# EAGLE design MotorDriver (EAGLE 5.11)
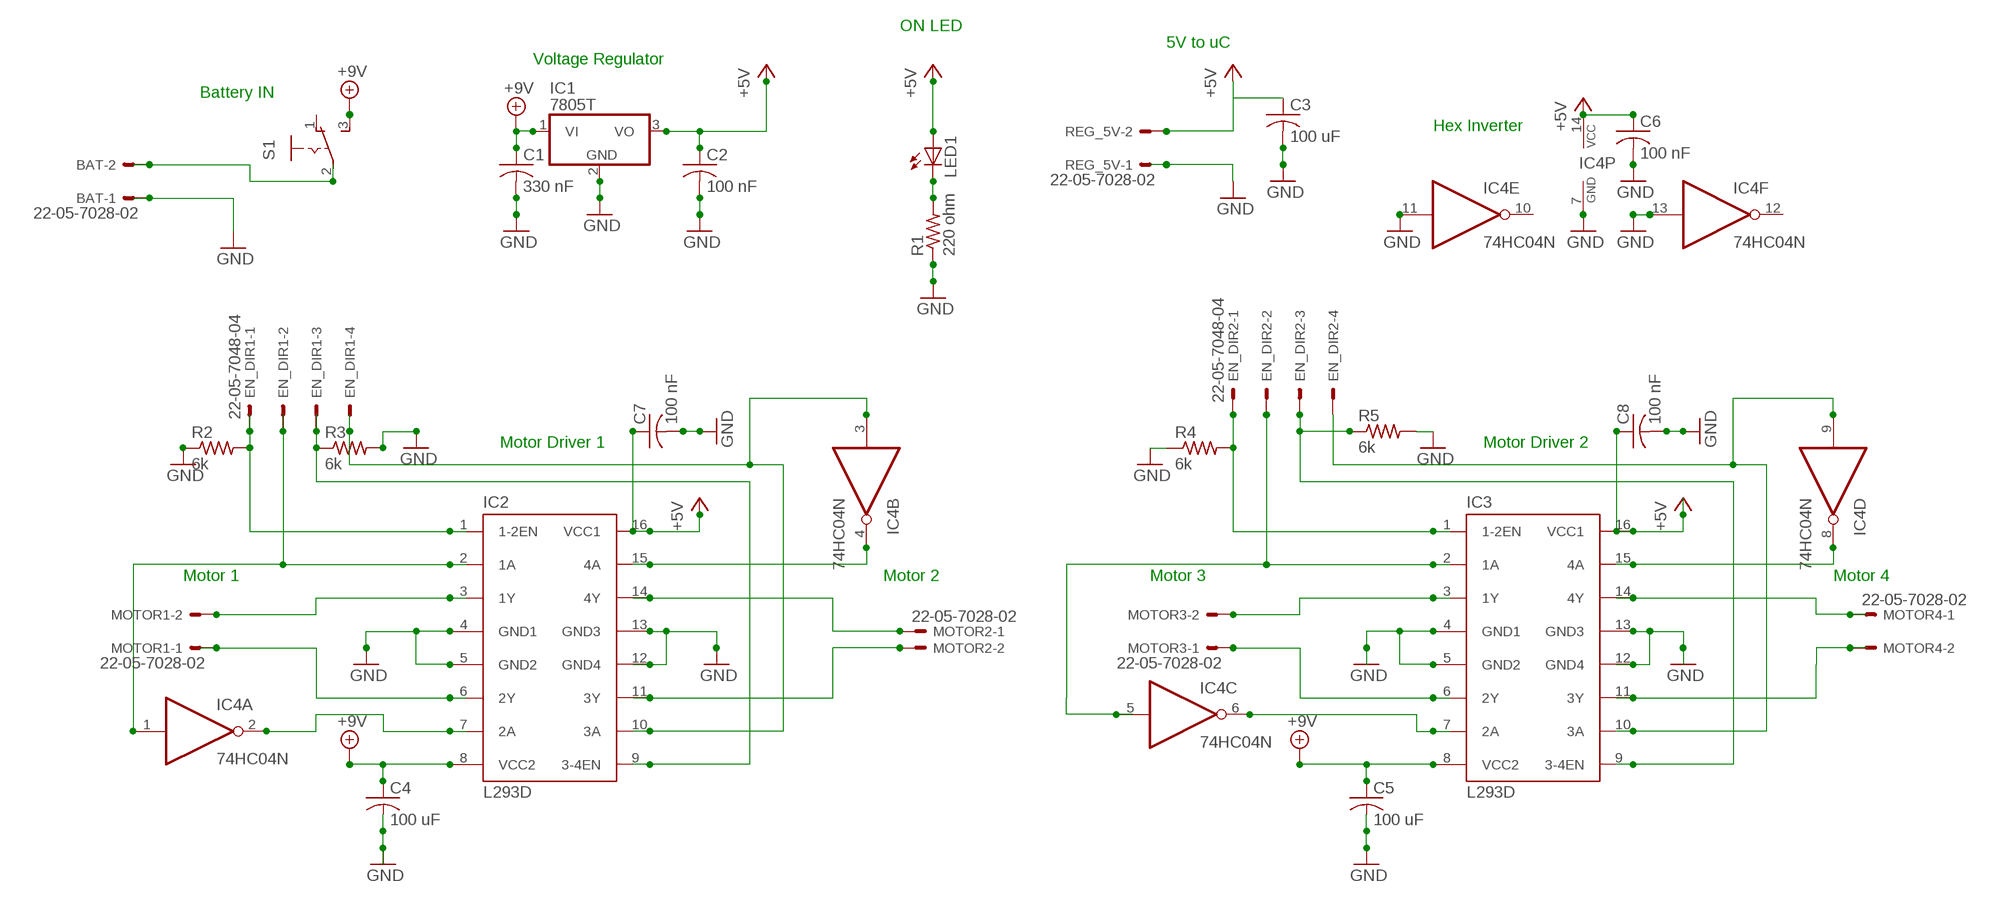
[diagram p0: schematic, sheet 1]

## Parts
BAT  22-05-7028-02  [7395-02]
C1  330 nF  C-US025-025X050  [C025-025X050]
C2  100 nF  C-US025-025X050  [C025-025X050]
C3  100 uF  C-US025-060X050  [C025-060X050]
C4  100 uF  C-US025-060X050  [C025-060X050]
C5  100 uF  C-US025-060X050  [C025-060X050]
C6  100 nF  C-US025-025X050  [C025-025X050]
C7  100 nF  C-US025-025X050  [C025-025X050]
C8  100 nF  C-US025-025X050  [C025-025X050]
EN_DIR1  22-05-7048-04  [7395-04]
EN_DIR2  22-05-7048-04  [7395-04]
IC1  7805T  [TO220H]
IC2  L293D  [DIL16]
IC3  L293D  [DIL16]
IC4  74HC04N  [DIL14]
LED1  LED3MM  [LED3MM]
MOTOR1  22-05-7028-02  [7395-02]
MOTOR2  22-05-7028-02  [7395-02]
MOTOR3  22-05-7028-02  [7395-02]
MOTOR4  22-05-7028-02  [7395-02]
R1  220 ohm  R-US_0207/7  [0207/7]
R2  6k  R-US_0207/7  [0207/7]
R3  6k  R-US_0207/7  [0207/7]
R4  6k  R-US_0207/7  [0207/7]
R5  6k  R-US_0207/7  [0207/7]
REG_5V  22-05-7028-02  [7395-02]
S1  255SB  [255SB]

## Nets
+5V: C2.1 C3.1 C6.1 C7.1 C8.1 IC1.3(VO) IC2.16(VCC1) IC3.16(VCC1) IC4.14(P:VCC) LED1.A REG_5V.2
+9V: C1.1 C4.1 C5.1 IC1.1(VI) IC2.8(VCC2) IC3.8(VCC2) S1.3(S)
EN_DIR1: EN_DIR1.4 IC2.10(3A) IC4.3(B:I)
EN_DIR2: EN_DIR2.4 IC3.10(3A) IC4.9(D:I)
GND: BAT.1 C1.2 C2.2 C3.2 C4.2 C5.2 C6.2 C7.2 C8.2 IC1.2(GND) IC2.4(GND1) IC2.5(GND2) IC2.12(GND4) IC2.13(GND3) IC3.4(GND1) IC3.5(GND2) IC3.12(GND4) IC3.13(GND3) IC4.7(P:GND) IC4.11(E:I) IC4.13(F:I) R1.1 R2.1 R3.2 R4.1 R5.2 REG_5V.1
N$1: BAT.2 S1.2(P)
N$2: EN_DIR1.1 EN_DIR2.2 IC2.1(1-2EN) IC3.2(1A) IC4.5(C:I) R2.2
N$3: EN_DIR1.3 IC2.9(3-4EN) R3.1
N$4: EN_DIR1.2 IC2.2(1A) IC4.1(A:I)
N$10: IC2.7(2A) IC4.2(A:O)
N$12: IC2.3(1Y) MOTOR1.2
N$13: IC2.6(2Y) MOTOR1.1
N$14: IC2.14(4Y) MOTOR2.1
N$15: IC2.11(3Y) MOTOR2.2
N$16: EN_DIR2.1 IC3.1(1-2EN) R4.2
N$17: EN_DIR2.3 IC3.9(3-4EN) R5.1
N$22: IC2.15(4A) IC4.4(B:O)
N$23: IC3.3(1Y) MOTOR3.2
N$24: IC3.6(2Y) MOTOR3.1
N$25: IC3.14(4Y) MOTOR4.1
N$26: IC3.11(3Y) MOTOR4.2
N$27: IC3.7(2A) IC4.6(C:O)
N$28: IC3.15(4A) IC4.8(D:O)
POWER_LED: LED1.K(C) R1.2
Unconnected: IC4.10(E:O) IC4.12(F:O) S1.1(O)

## Notes on the sheet
- ON LED
- 5V to uC
- Voltage Regulator
- Battery IN
- Hex Inverter
- Motor Driver 1 | Motor Driver 2
- Motor 1 | Motor 2 | Motor 3 | Motor 4

## Library data of the parts
BAT MOTOR1-MOTOR4 REG_5V = con-molex:22-?-02: CONNECTOR wire to board 2.54 mm (.1 inch) pitch header; OC_FARNELL: 9731601; OC_NEWARK: unknown
C1-C8 = rcl:C-US: CAPACITOR, American symbol
EN_DIR1 EN_DIR2 = con-molex:22-?-04: CONNECTOR wire to board 2.54 mm (.1 inch) pitch header; OC_FARNELL: unknown; OC_NEWARK: unknown
IC1 = linear:78*: Positive VOLTAGE REGULATOR Source: http://cache.national.com/ds/LM/LM78L05.pdf http://www.fairchildsemi.com/ds/LM/LM7805.pdf
IC2 IC3 = st-microelectronics:L293D: PUSH-PULL 4 CHANNEL DRIVER; MPN: L293D; OC_FARNELL: 9589619; OC_NEWARK: 56P8249
IC4 = 74xx-eu:74*04: Hex INVERTER
LED1 = led:LED: LED OSRAM: - CHIPLED LG R971, LG N971, LY N971, LG Q971, LY Q971, LO R971, LY R971 LH N974, LH R974 LS Q976, LO Q976, LY Q976 LO Q996 - Hyper CHIPLED LW Q18S LB Q993, LB Q99A, LB R99A - SideLED LS A670, LO A670, LY A670, LG A670, LP A670 LB A673, LV A673, LT A673, LW A673 LH A674 LY A675 LS A676, LA A676, LO A676, LY A676, LW A676 LS A679, LY A679, LG A679 - Hyper Micro SIDELED® LS Y876, LA Y876, LO Y876, LY Y876 LT Y87S - SmartLED LW L88C, LW L88S LB L89C, LB L89S, LG L890 LS L89K, LO L89K, LY L89K LS L896, LA L896, LO L896, LY L896 - TOPLED LS T670, LO T670, LY T670, LG T670, LP T670 LSG T670, LSP T670, LSY T670, LOP T670, LYG T670 LG T671, LOG T671, LSG T671 LB T673, LV T673, LT T673, LW T673 LH T674 LS T676, LA T676, LO T676, LY T676, LB T676, LH T676, LSB T676, LW T676 LB T67C, LV T67C, LT T67C, LS T67K, LO T67K, LY T67K, LW E67C LS E67B, LA E67B, LO E67B, LY E67B, LB E67C, LV E67C, LT E67C LW T67C LS T679, LY T679, LG T679 LS T770, LO T770, LY T770, LG T770, LP T770 LB T773, LV T773, LT T773, LW T773 LH T774 LS E675, LA E675, LY E675, LS T675 LS T776, LA T776, LO T776, LY T776, LB T776 LHGB T686 LT T68C, LB T68C - Hyper Mini TOPLED® LB M676 - Mini TOPLED Santana® LG M470 LS M47K, LO M47K, LY M47K Source: http://www.osram.convergy.de LUXEON: - LUMILED® LXK2-PW12-R00, LXK2-PW12-S00, LXK2-PW14-U00, LXK2-PW14-V00 LXK2-PM12-R00, LXK2-PM12-S00, LXK2-PM14-U00 LXK2-PE12-Q00, LXK2-PE12-R00, LXK2-PE12-S00, LXK2-PE14-T00, LXK2-PE14-U00 LXK2-PB12-K00, LXK2-PB12-L00, LXK2-PB12-M00, LXK2-PB14-N00, LXK2-PB14-P00, LXK2-PB14-Q00 LXK2-PR12-L00, LXK2-PR12-M00, LXK2-PR14-Q00, LXK2-PR14-R00 LXK2-PD12-Q00, LXK2-PD12-R00, LXK2-PD12-S00 LXK2-PH12-R00, LXK2-PH12-S00 LXK2-PL12-P00, LXK2-PL12-Q00, LXK2-PL12-R00 Source: www.luxeon.com KINGBRIGHT: KA-3528ASYC Source: www.kingbright.com
R1-R5 = rcl:R-US_: RESISTOR, American symbol
S1 = switch:255SB: SLIDING SWITCH Distributor Buerklin, 11G810

## Board
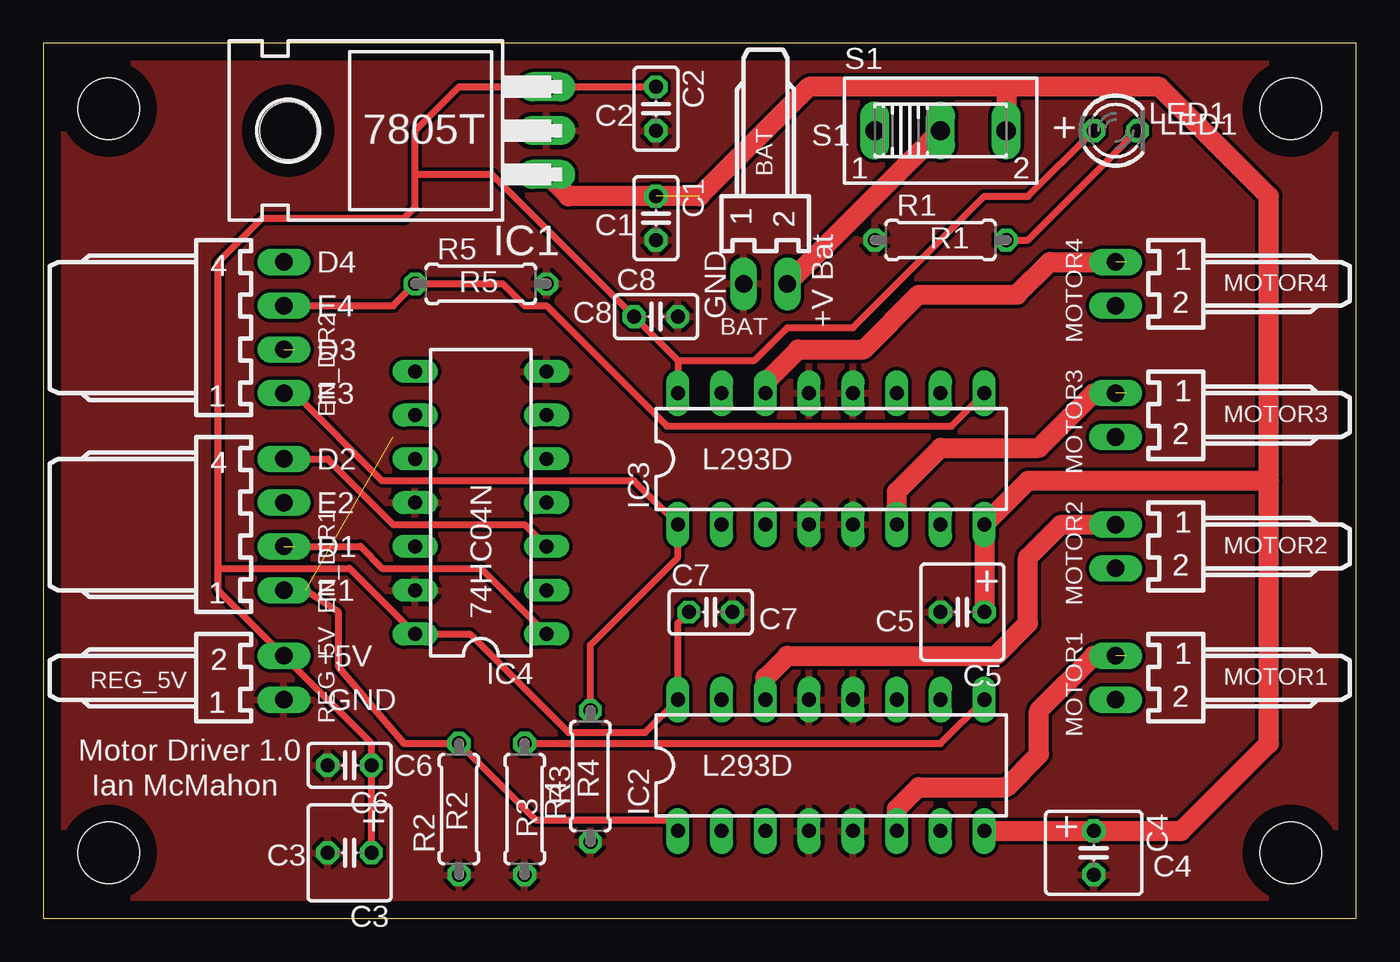
[diagram p1: board, top side]
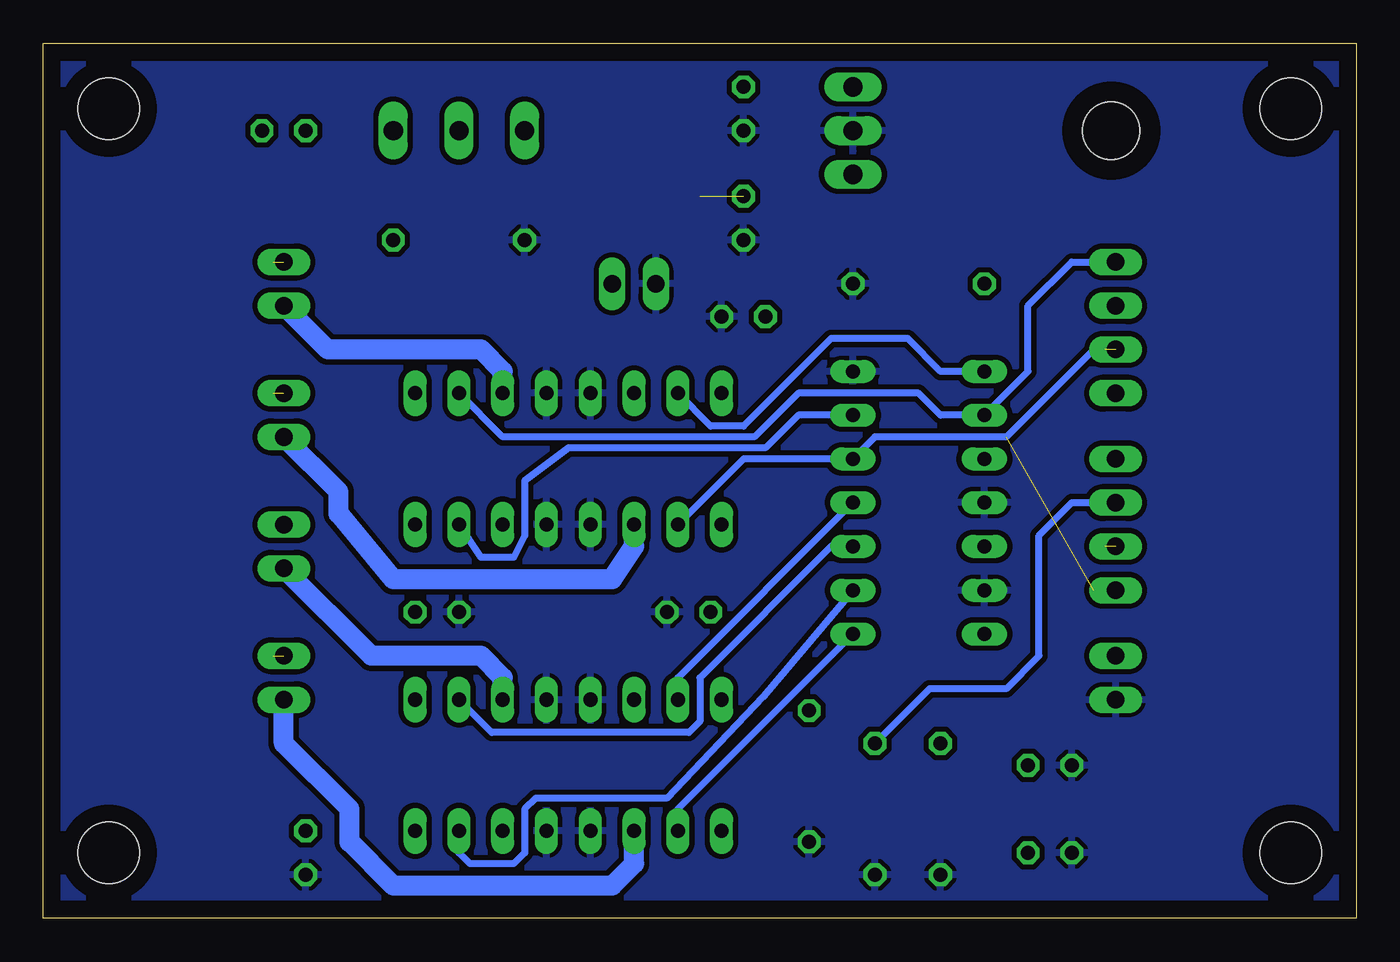
[diagram p2: board, bottom side, seen from below]

Size 76.2 x 50.8 mm. Coordinates in mm from the lower left corner, seen from the top.
Outline: 0,0 76.2,0 76.2,50.8 0,50.8 0,0
Copper layers (1*16): Top 0.035mm / dielectric 1.5mm / Bottom 0.035mm
Design rules "default": minimum track width 10mil, minimum drill 24mil, track to track 8mil, track to pad 8mil, pad to pad 8mil, via to via 8mil, smd to smd 8mil, copper to edge 40mil, drill to drill 8mil, minimum pad ring 10mil, minimum via ring 8mil, stop-mask expansion 4mil, vias tented up to drill 0mil, thermal gap 10mil
Holes 3.56 mm at 3.81,46.99 3.81,3.81 72.39,3.81 72.39,46.99

### Footprints (pad centres in the part's own frame; a part is rotated, then mirrored left to right if it is on the bottom)
7395-02 = drill 1.016 long: 1 1.27,0; 2 -1.27,0
C025-025X050 = drill 0.813 octagon: 1 -1.27,0; 2 1.27,0
C025-060X050 = drill 0.813 octagon: 1 -1.27,0; 2 1.27,0
7395-04 = drill 1.016 long: 1 3.81,0; 2 1.27,0; 3 -1.27,0; 4 -3.81,0
TO220H = drill 1.118 long: 1 -2.54,-10.16; 2 0,-10.16; 3 2.54,-10.16 | hole 3.302: 0,4.826
DIL16 = drill 0.813 long: 1 -8.89,-3.81; 2 -6.35,-3.81; 3 -3.81,-3.81; 4 -1.27,-3.81; 5 1.27,-3.81; 6 3.81,-3.81; 7 6.35,-3.81; 8 8.89,-3.81; 9 8.89,3.81; 10 6.35,3.81; 11 3.81,3.81; 12 1.27,3.81; 13 -1.27,3.81; 14 -3.81,3.81; 15 -6.35,3.81; 16 -8.89,3.81
DIL14 = drill 0.813 long: 1 -7.62,-3.81; 2 -5.08,-3.81; 3 -2.54,-3.81; 4 0,-3.81; 5 2.54,-3.81; 6 5.08,-3.81; 7 7.62,-3.81; 8 7.62,3.81; 9 5.08,3.81; 10 2.54,3.81; 11 0,3.81; 12 -2.54,3.81; 13 -5.08,3.81; 14 -7.62,3.81
LED3MM = drill 0.813 octagon: A -1.27,0; K 1.27,0
0207/7 = drill 0.813 octagon: 1 -3.81,0; 2 3.81,0
255SB = drill 1.118 long: 1 -3.81,0; 2 0,0; 3 3.81,0

### Placement (x,y rotation side)
BAT  41.91,36.83 180 top
C1  35.56,40.64 270 top
C2  35.56,46.99 270 top
C3  17.78,3.81 180 top
C4  60.96,3.81 270 top
C5  53.34,17.78 180 top
C6  17.78,8.89 180 top
C7  38.73,17.78 0 top
C8  35.56,34.92 0 top
EN_DIR1  13.97,22.86 270 top
EN_DIR2  13.97,34.29 270 top
IC1  19.05,45.72 90 top
IC2  45.72,8.89 0 top
IC3  45.72,26.67 0 top
IC4  25.4,24.13 90 top
LED1  62.23,45.72 0 top
MOTOR1  62.23,13.97 90 top
MOTOR2  62.23,21.59 90 top
MOTOR3  62.23,29.21 90 top
MOTOR4  62.23,36.83 90 top
R1  52.07,39.37 0 top
R2  24.13,6.35 90 top
R3  27.94,6.35 270 top
R4  31.75,8.26 90 top
R5  25.4,36.83 0 top
REG_5V  13.97,13.97 270 top
S1  52.07,45.72 0 top

### Tracks (layer width: path | path; a pad name or v marks a point on that pad's centre or on a via)
+5V
  Top 0.406: 21.59,43.18 21.59,45.72 24.13,48.26 IC1.3 C2.1 | 21.59,43.18 21.59,41.27 20.95,40.64 12.7,40.64 10.16,38.1 10.16,20.32 | 10.16,20.32 10.16,19.05 REG_5V.2 19.05,10.16 C6.1 C3.1 | 10.16,20.32 17.78,20.32 IC4.14 24.77,16.51 30.48,10.79 34.92,10.79 IC2.16 36.83,17.14 C7.1 | 21.59,43.18 26.04,43.18 C8.1 36.83,32.38 | 36.83,32.38 IC3.16 | 36.83,32.38 41.27,32.38 43.18,34.29 46.99,34.29 54.61,41.91 57.15,41.91 LED1.A
+9V  (1 unrouted)
  Top 1.168: C5.1 IC3.8 57.15,25.4 71.12,25.4 | IC2.8 C4.1 66.04,5.08 71.12,10.16 71.12,25.4 | 55.88,48.26 S1.3 | 55.88,48.26 64.77,48.26 71.12,41.91 71.12,25.4 | 55.88,48.26 44.45,48.26 38.1,41.91 30.48,41.91 IC1.1
EN_DIR1
  Top 0.406: EN_DIR1.4 16.51,26.67 20.32,22.86 27.94,22.86 IC4.3
  Bottom 0.406: IC4.3 30.48,21.59 38.1,13.97 38.1,11.43 38.73,10.79 50.16,10.79 IC2.10
EN_DIR2
  Bottom 0.406: EN_DIR2.4 16.51,38.1 19.05,35.56 19.05,31.75 IC4.9 24.13,29.21 25.4,30.48 32.38,30.48 34.92,27.94 49.53,27.94 IC3.10
GND
  pour Bottom (isolate 0.305): 0,50.8 0,0 76.2,0 76.2,50.8
  pour Top: 0,50.8 0,0 76.2,0 76.2,0.25 76.2,50.8
N$1
  Top 1.168: BAT.2 S1.2
N$2  (2 unrouted)
  Top 0.406: EN_DIR1.1 15.24,19.05 17.14,17.78 17.14,14.61 20.95,10.16 R2.2 28.57,5.71 36.2,5.71 IC2.1
  Bottom 0.406: 14.61,33.02 15.24,33.02 20.32,27.94 27.94,27.94 IC4.5 35.56,26.67 IC3.2
N$3
  Top 0.406: R3.1 52.07,10.16 IC2.9
  Bottom 0.406: EN_DIR1.3 16.51,24.13 18.41,22.23 18.41,15.24 20.32,13.34 24.77,13.34 R3.1
N$4  (1 unrouted)
  Top 0.406: 14.61,21.59 18.41,21.59 19.68,20.32 25.4,20.32 IC4.1
  Bottom 0.406: IC4.1 39.37,6.35 IC2.2
N$6
  Top 0.406: 32.05,4.26 31.98,4.26
N$10
  Bottom 0.406: IC4.2 34.4,12.88 40.01,6.99 47.62,6.99 48.26,6.35 48.26,3.81 48.9,3.17 51.44,3.17 52.07,3.81 IC2.7
N$12
  Bottom 1.168: IC2.3 41.91,3.17 43.18,1.91 55.88,1.91 58.42,4.45 58.42,6.35 62.23,10.16 MOTOR1.2
N$13  (1 unrouted)
  Top 1.168: IC2.6 49.53,6.35 50.8,7.62 55.88,7.62 57.78,9.53 57.78,12.06 60.96,15.24 62.87,15.24
N$14
  Top 1.168: IC2.14 41.91,13.97 43.18,15.24 55.24,15.24 57.15,17.14 57.15,20.95 59.05,22.86 MOTOR2.1 62.87,22.86
N$15
  Bottom 1.168: IC2.11 49.53,13.97 50.8,15.24 57.15,15.24 MOTOR2.2
N$16
  Top 0.406: EN_DIR2.1 14.61,30.48 19.68,25.4 34.29,25.4 IC3.1 36.83,20.95 31.75,15.88 R4.2
N$17
  Top 0.406: EN_DIR2.3 20.32,35.56 R5.1 26.67,36.83 27.94,35.56 29.21,35.56 36.2,28.57 52.7,28.57 IC3.9
N$22
  Bottom 0.406: IC4.4 39.37,13.97 IC2.15
N$23
  Bottom 1.168: IC3.3 41.91,21.59 43.18,19.68 55.88,19.68 59.05,23.5 59.05,24.77 MOTOR3.2
N$24  (1 unrouted)
  Top 1.168: IC3.6 49.53,24.77 52.07,27.3 57.78,27.3 60.96,30.48 62.87,30.48
N$25  (1 unrouted)
  Top 1.168: IC3.14 41.91,31.11 43.81,33.02 47.62,33.02 50.8,36.2 56.52,36.2 58.42,38.1 62.87,38.1
N$26
  Bottom 1.168: IC3.11 49.53,31.75 50.8,33.02 59.69,33.02 MOTOR4.2
N$27
  Bottom 0.406: IC4.6 32.38,29.21 34.29,27.3 45.72,27.3 48.26,25.4 48.26,22.23 48.9,20.95 50.8,20.95 IC3.7
N$28
  Bottom 0.406: IC4.8 24.13,31.75 26.04,33.66 30.48,33.66 35.56,28.57 37.47,28.57 IC3.15
POWER_LED
  Top 0.406: R1.2 57.15,39.37 LED1.K

### Text on the board
_tsilk: 7805T | C2 | S1 | + | LED1 | BAT | 1 | 2 | C1 | 1 | 2 | 4 | R1 | 1 | D4 | R5 | MOTOR4 | E4 | C8 | GND | 2 | +V Bat | D3 | 1 | E3 | 1 | MOTOR3 | 2 | 4 | D2 | L293D | E2 | 1 | D1 | MOTOR2 | 1 | 2 | + | E1 | C5 | 74HC04N | C7 | 2 | +5V | 1 | REG_5V | MOTOR1 | 1 | GND | 2 | C6 | Motor Driver 1.0 | L293D | Ian McMahon | R3 | R4 | + | R2 | C3 | + | C4